# Altium schematic sheet main.SchDoc
size A
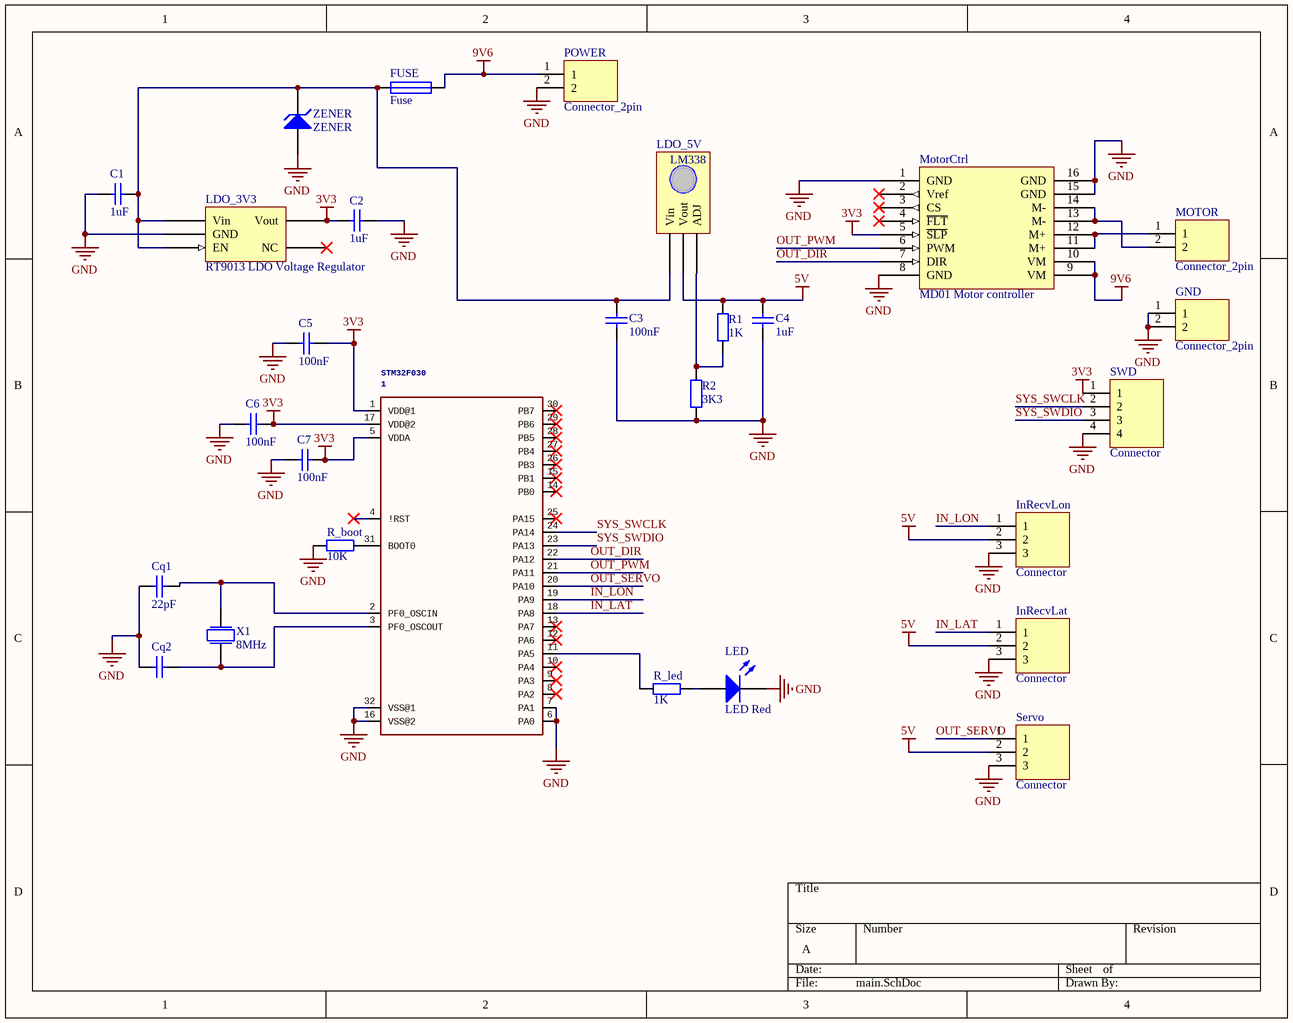
[diagram p0: main.SchDoc]

## Parts
1  STM32F030  [TQFP32-08]
C1  1uF  [FP_0805_CAP_085]
C2  1uF  [FP_0805_CAP_085]
C3  100nF  [FP_0805_CAP_085]
C4  1uF  [FP_0805_CAP_085]
C5  100nF  [FP_0805_CAP_085]
C6  100nF  [FP_0805_CAP_085]
C7  100nF  [FP_0805_CAP_085]
Cq1  22pF  [FP_0805_CAP_085]
Cq2  (no value)  [FP_0805_CAP_085]
FUSE  Fuse  [FP_1812_MULTIFUSE]
GND  Connector_2pin  [PT_2-5]
InRecvLat  Connector  [FP_CONN3_TUSKE_254MM]
InRecvLon  Connector  [FP_CONN3_TUSKE_254MM]
LDO_3V3  RT9013 LDO Voltage Regulator  [RT9013_SOT23]
LDO_5V  LM338  [LM338]
LED  LED Red  [FP_0805_LED_RED]
MOTOR  Connector_2pin  [PT_2-5]
MotorCtrl  MD01 Motor controller  [MD01]
POWER  Connector_2pin  [PT_2-5]
R1  1K  [FP_0805_RES]
R2  3K3  [FP_0805_RES]
R_boot  10K  [FP_0805_RES]
R_led  1K  [FP_0805_RES]
Servo  Connector  [FP_CONN3_TUSKE_254MM]
SWD  Connector  [FP_CONN4_TUSKE_254MM]
X1  8MHz  [FP_CRYSTAL_HC49_SMD]
ZENER  ZENER  [FP_SMA]

## Nets
3V3: 1.1(VDD@1) 1.5(VDDA) 1.17(VDD@2) C2.1 C5.2 C6.2 C7.2 LDO_3V3.Vout MotorCtrl.5(~{SLP}) SWD.1
5V: C4.2 InRecvLat.2 InRecvLon.2 LDO_5V.Vout R1.1 Servo.2
9V6: FUSE.2 MotorCtrl.9(VM) MotorCtrl.10(VM) POWER.1
GND: 1.6(PA0) 1.7(PA1) 1.16(VSS@2) 1.32(VSS@1) C1.1 C2.2 C3.1 C4.1 C5.1 C6.1 C7.1 Cq1.1 Cq2.1 GND.1 GND.2 InRecvLat.3 InRecvLon.3 LDO_3V3.GND LED.2(K) MotorCtrl.1(GND) MotorCtrl.8(GND) MotorCtrl.15(GND) MotorCtrl.16(GND) POWER.2 R2.1 R_boot.1 Servo.3 SWD.4 ZENER.1(A)
IN_LAT: 1.18(PA8) InRecvLat.1
IN_LON: 1.19(PA9) InRecvLon.1
OUT_DIR: 1.22(PA12) MotorCtrl.7(DIR)
OUT_PWM: 1.21(PA11) MotorCtrl.6(PWM)
OUT_SERVO: 1.20(PA10) Servo.1
SYS_SWCLK: 1.24(PA14) SWD.2
SYS_SWDIO: 1.23(PA13) SWD.3
Net1_2: 1.2(PF0_OSCIN) Cq1.2 X1.2
Net1_3: 1.3(PF0_OSCOUT) Cq2.2 X1.1
Net1_11: 1.11(PA5) R_led.2
Net1_31: 1.31(BOOT0) R_boot.2
NetC1_2: C1.2 C3.2 FUSE.1 LDO_3V3.EN LDO_3V3.Vin LDO_5V.Vin ZENER.2(K)
NetLDO_5V_ADJ: LDO_5V.ADJ R1.2 R2.2
NetLED_1: LED.1(A) R_led.1
NetMOTOR_1: MOTOR.1 MotorCtrl.11(M+) MotorCtrl.12(M+)
NetMOTOR_2: MOTOR.2 MotorCtrl.13(M-) MotorCtrl.14(M-)

Not connected (* = marked no-connect by the designer): 1 4(!RST)* 8(PA2)* 9(PA3)* 10(PA4)* 12(PA6)* 13(PA7)* 14(PB0)* 15(PB1)* 25(PA15)* 26(PB3)* 27(PB4)* 28(PB5)* 29(PB6)* 30(PB7)*; LDO_3V3 NC*; MotorCtrl 2(Vref)* 3(CS)* 4(~{FLT})*

## Library data of the parts
1 = STM32F030: GateName_1: G$1; SymbolName_1: STM32F030X; LibraryName: stm32F030x; DeviceSetName: STM32F030; Package: TQFP32-08
C1 C2 C4 = CAP 1uF: Capacitor; Tolerance: +80%/-20%; Voltage: 25V; Reference: 1828853; Name: SMD Multilayer Ceramic Capacitor, 0805; Supplier: Farnell; Value: 1uF
C3 C5-C7 = CAP 100nF: Capacitor; Tolerance: +80%/-20%; Voltage: 25V; Reference: 1759167; Name: SMD Multilayer Ceramic Capacitor, 0805; Supplier: Farnell; Value: 100nF
Cq1 Cq2 = CAP 22pF: Capacitor; Tolerance: 5%; Voltage: 50V; Reference: 1759195; Name: SMD Multilayer Ceramic Capacitor, 0805; Supplier: Farnell
  Cq1: Value: 22pF
InRecvLat InRecvLon Servo = Connector_3pin: 3pin connector
LDO_3V3 = RT9013: LDO Voltage Regulator
LDO_5V = LM338: Voltage regulator; Name: LM338 Voltage regulator; Supplier: Lomex; Reference: 32-04-33
LED = LED Red: Red LED; pin to pad: 1>A 2>K; U_fw: 1.85V; I_max: 20mA; Reference: 1581239; Name: MULTICOMP  MCL-S270SRC  LED, Red, SMD, 1.25mm x 1.4mm, 20 mA, 1.85 V, 643 nm; Wavelength: 643nm; Supplier: Farnell
MotorCtrl = MD01: Motor controller module
R1 R_led = RES 1K: Resistor; Tolerance: 5%; Power: 125mW; Name: YAGEO (PHYCOMP)  RC0805JR-071KL  SMD Chip Resistor, Thick Film, 1 kohm; Reference: 9234004; Supplier: Farnell; Value: 1K
R2 = RES 3K3: Resistor; Tolerance: 1%; Power: 125mW; Name: YAGEO (PHYCOMP)  RC0805FR-073K3L  SMD Chip Resistor, Thick Film, 3.3 kohm, 150 V, 0805 [2012 Metric], 125 mW, ± 1%, RC Series; Reference: 9237682; Supplier: Farnell; Value: 3K3
R_boot = RES 10K: Resistor; Tolerance: 5%; Power: 125mW; Name: YAGEO (PHYCOMP)  RC0805JR-0710KL  SMD Chip Resistor, Thick Film, 10 kohm; Reference: 9234136; Supplier: Farnell; Value: 10K
SWD = Connector_4pin: 4pin Connector
X1 = Crystal: Quarz Crystal; Value: 8MHz
ZENER = ZENER: Zener Diode; U_Z: 24